# Altium schematic sheet cover.SchDoc
size A3; SheetNumber: 1; SheetTotal: 5; Page Size: A3; Prepared By: Rumeysa Şahin
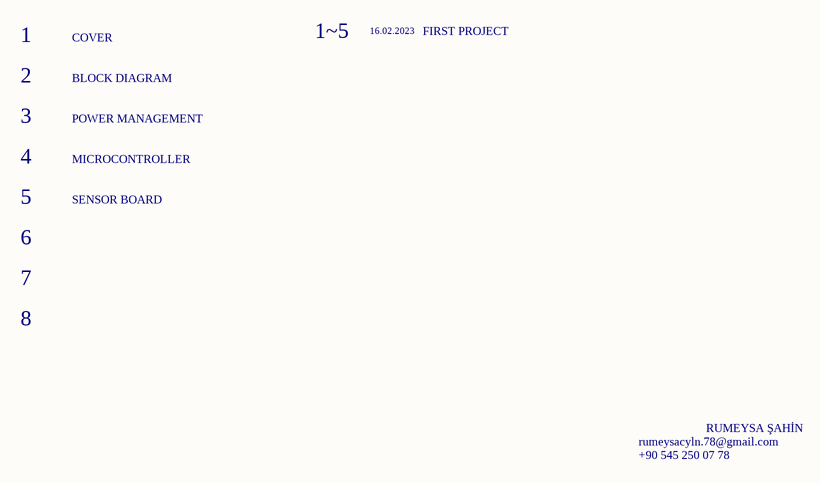
[diagram p0: cover.SchDoc]

## Notes on the sheet
- 1
- 2
- COVER
- BLOCK DIAGRAM
- 1~5
- 16.02.2023
- FIRST PROJECT
- 3
- POWER MANAGEMENT
- 4
- 5
- MICROCONTROLLER
- SENSOR BOARD
- 6
- 7
- 8
- rumeysacyln.78@gmail.com
- +90 545 250 07 78
- RUMEYSA ŞAHİN
- REVISION
- PAGE NO
- CONTENTS
- DESCRIPTIONS
- DATE
- PRODUCTION NOTES
- PROPERTIES
- BOARD
- GERBER
- FILES
- ADDENDA
- CONTACT
- FILE NAME
- DESCRIPTION
- APPROVED BY
- PREPARED BY
- CHECKED BY
- RELEASE DATE
- CHANGED DATE
- SIZE
- SHEET
- DEPERTMANT
- A3